# Altium schematic sheet Mezclador1.SchDoc
size A4
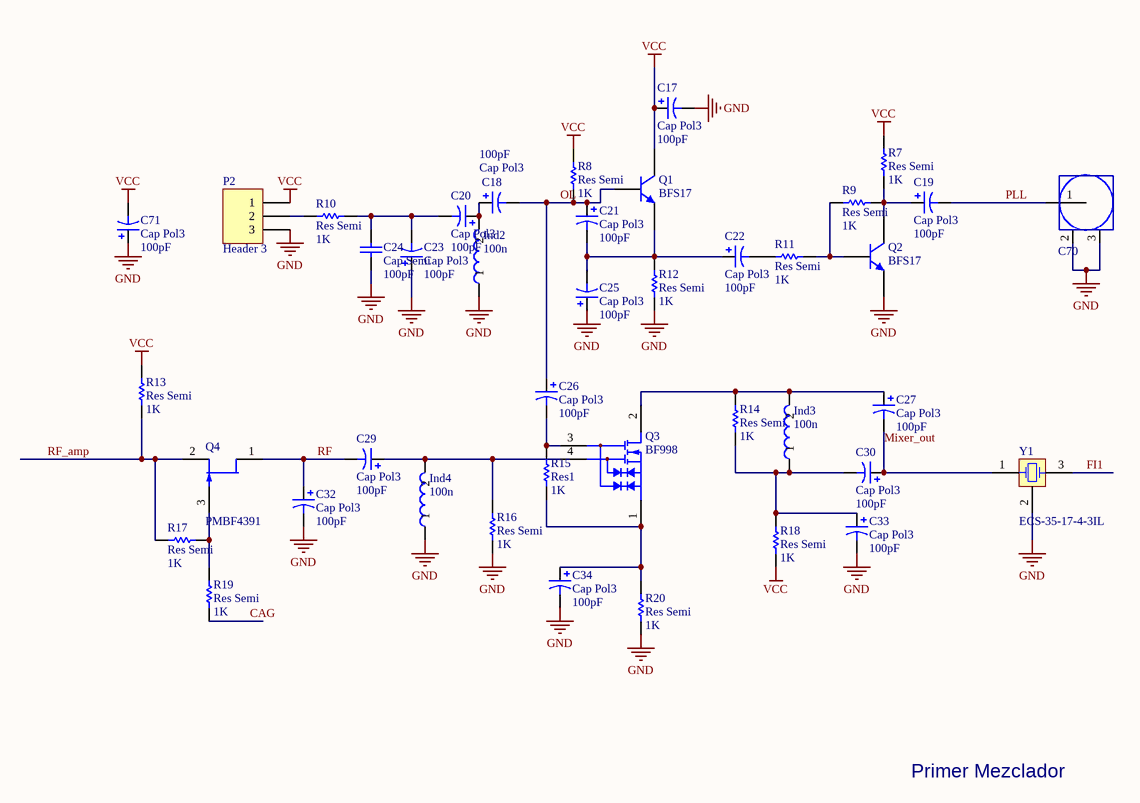
[diagram p0: Mezclador1.SchDoc]

## Parts
C17  Cap Pol3  value 100pF  [C0805]
C18  Cap Pol3  value 100pF  [C0805]
C19  Cap Pol3  value 100pF  [C0805]
C20  Cap Pol3  value 100pF  [C0805]
C21  Cap Pol3  value 100pF  [C0805]
C22  Cap Pol3  value 100pF  [C0805]
C23  Cap Pol3  value 100pF  [C0805]
C24  Cap Semi  value 100pF  [C1206]
C25  Cap Pol3  value 100pF  [C0805]
C26  Cap Pol3  value 100pF  [C0805]
C27  Cap Pol3  value 100pF  [C0805]
C29  Cap Pol3  value 100pF  [C0805]
C30  Cap Pol3  value 100pF  [C0805]
C32  Cap Pol3  value 100pF  [C0805]
C33  Cap Pol3  value 100pF  [C0805]
C34  Cap Pol3  value 100pF  [C0805]
C70  SMA_2  [SMA-2holeD]  (value not drawn)
C71  Cap Pol3  value 100pF  [C0805]
Ind2  Valor: 100n  [Ind_4mm]  (hidden comment: Ind2)
Ind3  Valor: 100n  [AXIAL-0.3]  (hidden comment: Ind2)
Ind4  Valor: 100n  [Ind_3mm]  (hidden comment: Ind2)
P2  Header 3  [HDR1X3]
Q1  BFS17  [SOT-23]
Q2  BFS17  [SOT23_N]
Q3  BF998  [SOT-143]
Q4  PMBF4391  [SOT-23]
R7  Res Semi  value 1K  [2012[0805]]
R8  Res Semi  value 1K  [2012[0805]]
R9  Res Semi  value 1K  [2012[0805]]
R10  Res Semi  value 1K  [2012[0805]]
R11  Res Semi  value 1K  [2012[0805]]
R12  Res Semi  value 1K  [2012[0805]]
R13  Res Semi  value 1K  [2012[0805]]
R14  Res Semi  value 1K  [2012[0805]]
R15  Res1  value 1K  [AXIAL-0.3]
R16  Res Semi  value 1K  [2012[0805]]
R17  Res Semi  value 1K  [2012[0805]]
R18  Res Semi  value 1K  [2012[0805]]
R19  Res Semi  value 1K  [2012[0805]]
R20  Res Semi  value 1K  [2012[0805]]
Y1  ECS-35-17-4-3IL  [HC-49US]

## Nets
GND: C17.2 C23.1 C24.2 C25.1 C32.2 C33.2 C34.2 C70.2(GND) C70.3(GND) C71.1 Ind2.1 Ind4.1 P2.3 Q2.2(E) R12.1 R16.1 R20.1 Y1.2(COM)
VCC: C17.1 C71.2 P2.1 Q1.3(C) R7.1 R8.2 R13.2 R18.1
CAG: R19.2
FI1: Y1.3(OSC2)
Mixer_out: C27.2 C30.1 Y1.1(OSC1)
OL: C18.2 C21.1 C26.1 Q1.1(B) R8.1
PLL: C19.2 C70.1(RF)
RF: C29.2 C32.1 Q4.1(D)
RF_amp: Q4.2(S) R13.1 R17.1
NetC18_1: C18.1 C20.1 Ind2.2
NetC19_1: C19.1 Q2.3(C) R7.2 R9.1
NetC20_2: C20.2 C23.2 C24.1 R10.2
NetC21_2: C21.2 C22.1 C25.2 Q1.2(E) R12.2
NetC22_2: C22.2 R11.2
NetC26_2: C26.2 Q3.3(G2) R15.2
NetC27_1: C27.1 Ind3.2 Q3.2(D) R14.2
NetC29_1: C29.1 Ind4.2 Q3.4(G1) R16.2
NetC30_2: C30.2 C33.1 Ind3.1 R14.1 R18.2
NetC34_1: C34.1 Q3.1(S) R15.1 R20.2
NetP2_2: P2.2 R10.1
NetQ2_1: Q2.1(B) R9.2 R11.1
NetQ4_3: Q4.3(G) R17.2 R19.1

## Notes on the sheet
- Primer Mezclador

## Library data of the parts
C17-C23 C25-C27 C29 C30 C32-C34 C71 = Cap Pol3: Polarized Capacitor (Surface Mount); Published: 8-Jun-2000; LatestRevisionDate: 17-Jul-2002; LatestRevisionNote: Re-released for DXP Platform.; PackageReference: C0805; Publisher: Altium Limited
C24 = Cap Semi: Capacitor (Semiconductor SIM Model); Published: 8-Jun-2000; LatestRevisionDate: 17-Jul-2002; LatestRevisionNote: Re-released for DXP Platform.; PackageReference: C1206; Publisher: Altium Limited
P2 = Header 3: Header, 3-Pin; LatestRevisionDate: 17-Jul-2002; LatestRevisionNote: Re-released for DXP Platform.; Publisher: Altium Limited
Q1 Q2 = BFS17: NPN 1 GHz Wideband Transistor; Published: 17-Sep-2003; LatestRevisionDate: 12-Dec-2006; LatestRevisionNote: IPC-7351 Footprint Added.; DatasheetVersion: Sep-1995; PackageVersion: May-1999; PackageReference: SOT23; Publisher: Altium Limited; PackageDescription: 3-Pin SOT-23 Package 0.95 mm Pitch, 2.3 mm Lead Span; ComponentLink1Description: Manufacturer Link; ComponentLink1URL: http://www.semiconductors.philips.com/; ComponentLink2Description: Datasheet; ComponentLink2URL: http://www.semiconductors.philips.com/acrobat/datasheets/BFS17_2.pdf
Q3 = BF998: Silicon N-channel Dual-gate MOSFET; Published: 17-Sep-2003; LatestRevisionDate: 12-Dec-2006; LatestRevisionNote: IPC-7351 Footprint Added.; DatasheetVersion: Aug-1996; PackageVersion: Sep-1996; PackageReference: SOT143; Publisher: Altium Limited; PackageDescription: 4-Pin SOT-143 Package 1.9 mm Pitch, 2.3 mm Lead Span; Code_IPC: SOT143; ComponentLink1Description: Manufacturer Link; ComponentLink1URL: http://www.semiconductors.philips.com/; ComponentLink2Description: Datasheet; ComponentLink2URL: http://www.semiconductors.philips.com/acrobat/datasheets/BF998_2.pdf
Q4 = PMBF4391: N-channel Silicon Junction Field-effect Transistor; Published: 17-Sep-2003; LatestRevisionDate: 12-Dec-2006; LatestRevisionNote: IPC-7351 Footprint Added.; DatasheetVersion: Apr-1995; PackageVersion: May-1999; PackageReference: SOT23; Publisher: Altium Limited; PackageDescription: 3-Pin SOT-23 Package 0.95 mm Pitch, 2.3 mm Lead Span; ComponentLink1Description: Manufacturer Link; ComponentLink1URL: http://www.semiconductors.philips.com/; ComponentLink2Description: Datasheet; ComponentLink2URL: http://www.semiconductors.philips.com/acrobat/datasheets/PMBF4391_4392_4393_CNV_2.pdf
R7-R14 R16-R20 = Res Semi: Semiconductor Resistor; Published: 8-Jun-2000; LatestRevisionDate: 17-Jul-2002; LatestRevisionNote: Re-released for DXP Platform.; PackageReference: AXIAL-0.5; Publisher: Altium Limited
R15 = Res1: Resistor; Published: 8-Jun-2000; LatestRevisionDate: 17-Jul-2002; LatestRevisionNote: Re-released for DXP Platform.; PackageReference: AXIAL-0.3; Publisher: Altium Limited
Y1 = ECS-35-17-4-3IL: Crystal Oscillator, 3rd In-Line Lead Version; Published: 17-Jul-2002; DatasheetDocument: 18-Apr-2000; PackageReference: HC-49US; Publisher: Altium Limited; ComponentLink1Description: Manufacturer Link; ComponentLink1URL: http://www.ecsxtal.com/; ComponentLink2Description: Datasheet; ComponentLink2URL: http://www.ecsxtal.com/pdf3/HC_49US.pdf